# Altium schematic sheet V1.0.SchDoc
size 127 x 50 mm
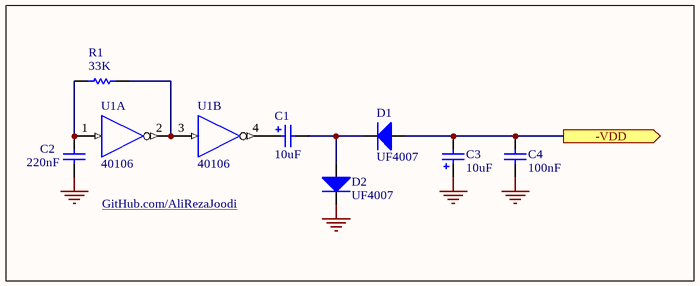
[diagram p0: V1.0.SchDoc]

## Parts
C1  10uF  [CAPPR2.5-5x6]
C2  220nF  [CAPNTO5.08-7.37x3.94]
C3  10uF  [CAPPR2.5-5x6]
C4  100nF  [CAPNTO2.54-3.05x1.78A]
D1  UF4007  [DIODE0.5_]
D2  UF4007  [DIODE0.5_]
R1  33K  [AXIAL-0.4]
U1  40106  [DIP14]  (parts A,B of 7)

## Ports
-VDD (out)

## Nets
GND: C2.1 C3.1 C4.1 D2.2(K)
-VDD: C3.2 C4.2 D1.1(A) ; port -VDD
NetC1_1: C1.1 U1.4(~{O})
NetC1_2: C1.2 D1.2(K) D2.1(A)
NetC2_2: C2.2 R1.2 U1.1(I)
NetR1_1: R1.1 U1.2(~{O}) U1.3(I)

## Notes on the sheet
- GitHub.com/AliRezaJoodi

## Library data of the parts
C1 C3 = Cap Pol1: Polarized Capacitor (Radial); Manufacturer: Generic Components; Class I: Passive; Published: 8-Jun-2000; Revision: July-2002: Re-released for DXP Platform.; Publisher: Altium Limited; Class II: Capacitor
C2 = Cap: Capacitor; Published: 8-Jun-2000; LatestRevisionDate: 17-Jul-2002; LatestRevisionNote: Re-released for DXP Platform.; PackageReference: RAD-0.3; Publisher: Altium Limited; Value: 220nF
C4 = Cap: Capacitor; Manufacturer: Generic Components; Class I: Passive; Published: 8-Jun-2000; Revision: July-2002: Re-released for DXP Platform.; Publisher: Altium Limited; Class II: Capacitor; Value: 100nF
D1 D2 = Diode: Default Diode; Manufacturer: Generic Components; Class I: Discrete; Class II: Diode - Switching; Published: 8-Jun-2000; Revision: July-2002: Re-released for DXP Platform.; Publisher: Altium Limited
R1 = Res1: Resistor; Published: 8-Jun-2000; LatestRevisionDate: 17-Jul-2002; LatestRevisionNote: Re-released for DXP Platform.; PackageReference: AXIAL-0.3; Publisher: Altium Limited
U1 = 40106: Hex inverting Schmitt trigger, 14-Pin; Publisher: Altium Limited; ComponentLink1URL: http://www.nxp.com